# EAGLE design M8-Keypad-LCD (EAGLE 9.5.2)
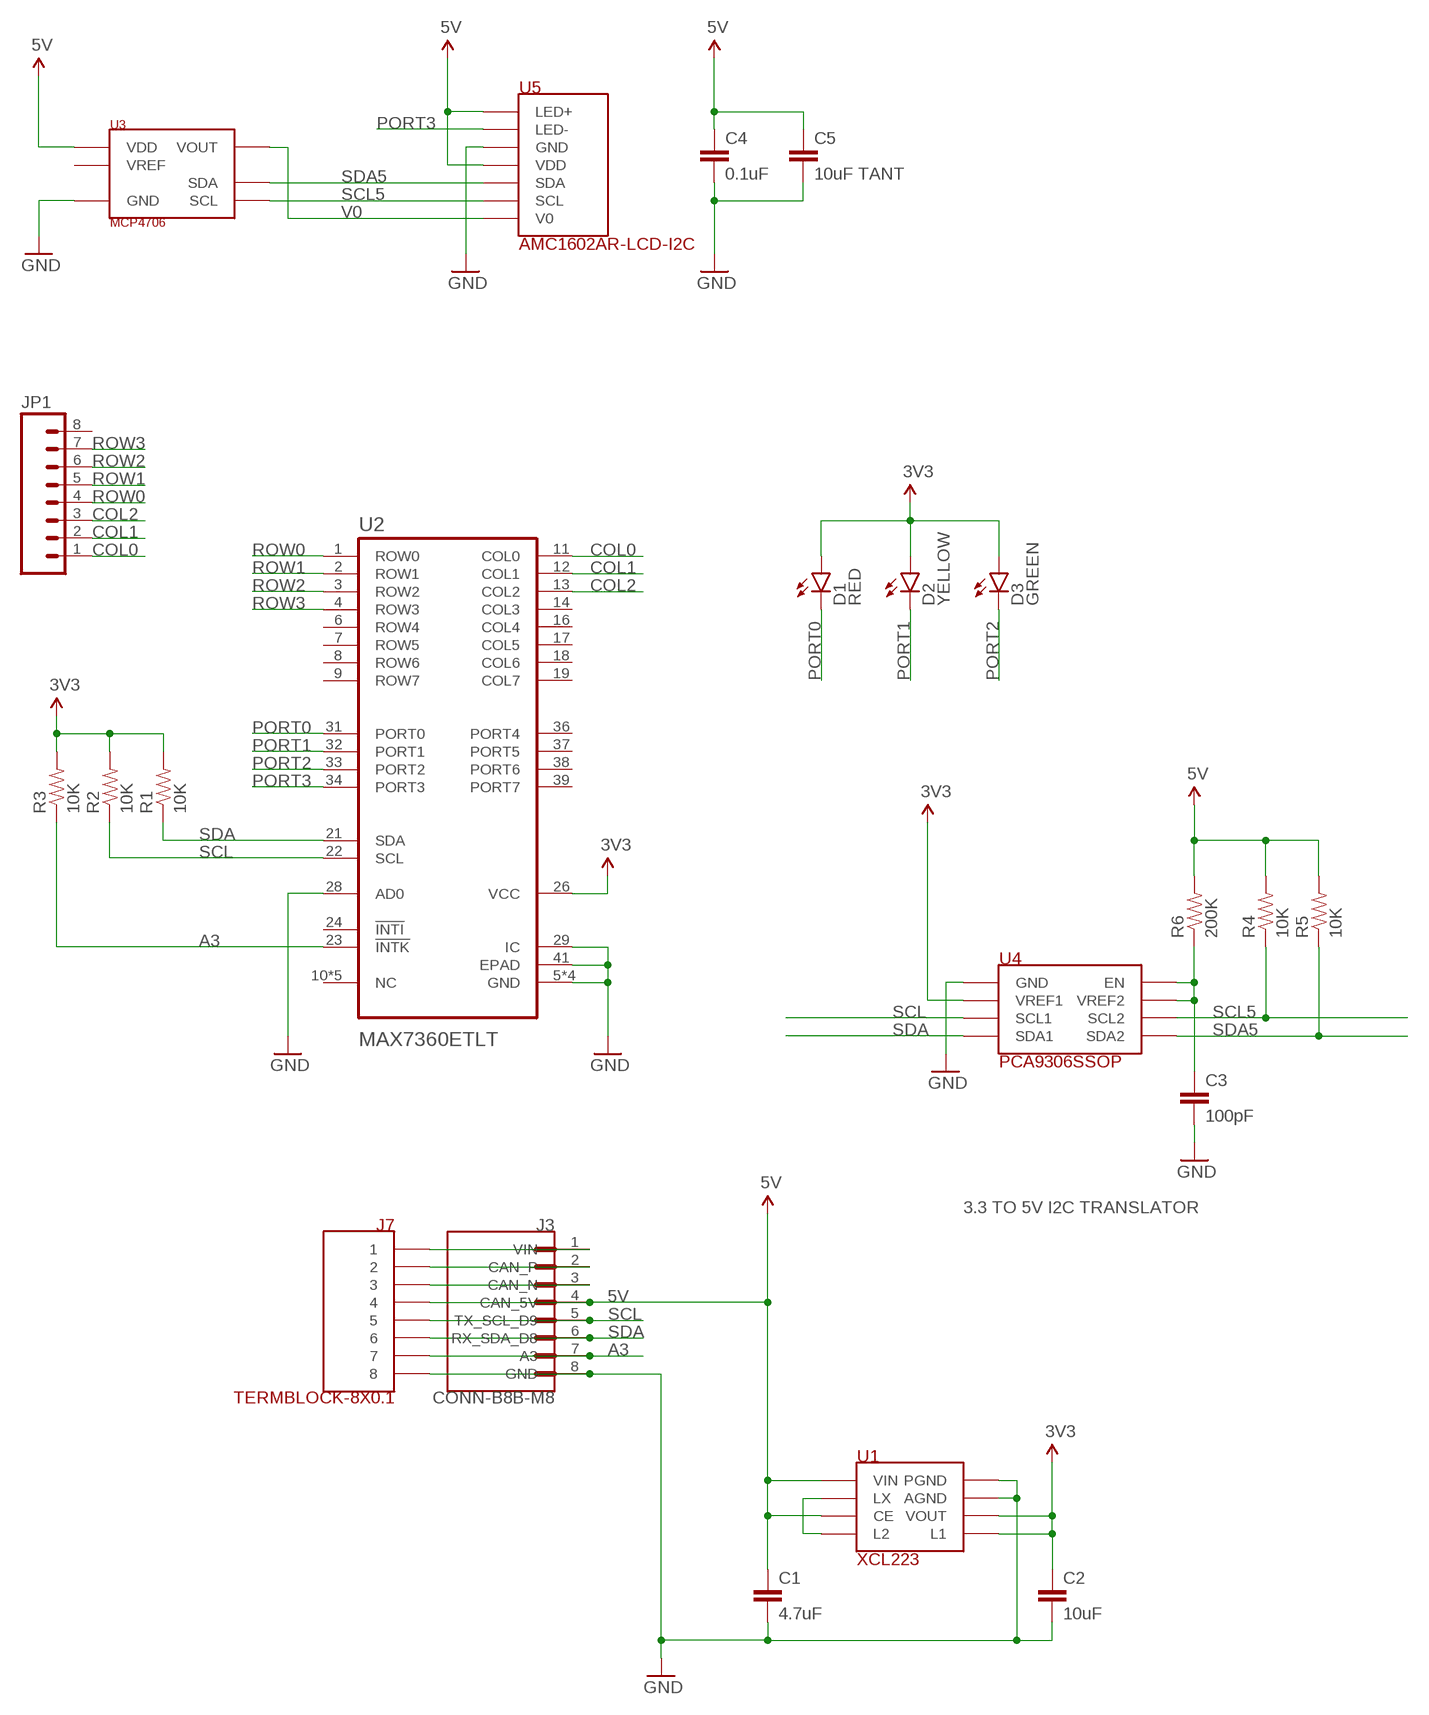
[diagram p0: schematic, sheet 1]

## Parts
C1  4.7uF  CAP-4.7UF-0603  [0603-CAP]
C2  10uF  CAP-10UF-0603  [0603-CAP]
C3  100pF  CAP-100PF-0603  [0603-CAP]
C4  0.1uF  CAP-0.1UF-0603  [0603-CAP]
C5  10uF TANT  CAP-10UF-1206-TANTALUM  [1206-KEMET]
D1  RED  LED-RED  [LED-0603]
D2  YELLOW  LED-YELLOW0603  [LED-0603]
D3  GREEN  LED-GREEN0603  [LED-0603]
J3  CONN-B8B-M8  [JST_B8B-PH-SM4-TB(LF)(SN)]
J7  TERMBLOCK-8X0.1  [TERMBLOCK-8X0.1]
JP1  M08SILK_FEMALE_PTH  [1X08]
R1  10K  RES-10K-06030603  [0603-RES]
R2  10K  RES-10K-06030603  [0603-RES]
R3  10K  RES-10K-06030603  [0603-RES]
R4  10K  RES-10K-06030603  [0603-RES]
R5  10K  RES-10K-06030603  [0603-RES]
R6  200K  RES-200K-0603  [0603-RES]
U1  XCL223  REG-XCL223  [REG-XCL223-LESS-CREAM]
U2  MAX7360ETLT  [QFN40P500X500X80-41N]
U3  MCP4706  MCP4706-DAC-I2C  [SOT-23-6-MICROCHIP]
U4  PCA9306SSOP  [8-SSOP-TI]
U5  AMC1602AR-LCD-I2C  [AMC1602AR]

## Nets
3V3: C2.1 D1.A D2.A D3.A R1.2 R2.2 R3.2 U1.3(VOUT) U1.7(L1) U2.26(VCC) U4.2(VREF1)
5V: C1.1 C4.1 C5.1 J3.4(CAN_5V) J7.P$4 R4.2 R5.2 R6.2 U1.4(CE) U1.6(VIN) U3.3(VDD) U5.1(LED+) U5.4(VDD)
A3: J3.7(A3) J7.P$7 R3.1 U2.23(!INTK)
CAN+: J3.2(CAN_P) J7.P$2
CAN-: J3.3(CAN_N) J7.P$3
COL0: JP1.1 U2.11(COL0)
COL1: JP1.2 U2.12(COL1)
COL2: JP1.3 U2.13(COL2)
GND: C1.2 C2.2 C3.2 C4.2 C5.2 J3.8(GND) J7.P$8 U1.1(PGND) U1.2(AGND) U2.5(GND) U2.15(GND) U2.25(GND) U2.28(AD0) U2.29(IC) U2.35(GND) U2.41(EPAD) U3.2(GND) U4.1(GND) U5.3(GND)
LX: U1.5(LX) U1.8(L2)
PORT0: D1.C U2.31(PORT0)
PORT1: D2.C U2.32(PORT1)
PORT2: D3.C U2.33(PORT2)
PORT3: U2.34(PORT3) U5.2(LED-)
ROW0: JP1.4 U2.1(ROW0)
ROW1: JP1.5 U2.2(ROW1)
ROW2: JP1.6 U2.3(ROW2)
ROW3: JP1.7 U2.4(ROW3)
SCL: J3.5(TX_SCL_D9) J7.P$5 R2.1 U2.22(SCL) U4.3(SCL1)
SCL5: R4.1 U3.5(SCL) U4.6(SCL2) U5.6(SCL)
SDA: J3.6(RX_SDA_D8) J7.P$6 R1.1 U2.21(SDA) U4.4(SDA1)
SDA5: R5.1 U3.4(SDA) U4.5(SDA2) U5.5(SDA)
V0: U3.1(VOUT) U5.7(V0)
VIN: J3.1(VIN) J7.P$1
VREF2_EN: C3.1 R6.1 U4.7(VREF2) U4.8(EN)
Unconnected: JP1.8 U2.6(ROW4) U2.7(ROW5) U2.8(ROW6) U2.9(ROW7) U2.10(NC) U2.14(COL3) U2.16(COL4) U2.17(COL5) U2.18(COL6) U2.19(COL7) U2.20(NC) U2.24(!INTI) U2.27(NC) U2.30(NC) U2.36(PORT4) U2.37(PORT5) U2.38(PORT6) U2.39(PORT7) U2.40(NC) U3.6(VREF)

## Notes on the sheet
- 3.3 TO 5V I2C TRANSLATOR

## Library data of the parts
C1 = rickk2:CAP-4.7UF-0603: Murata X5R series CAP CER 4.7UF 6.3V X5R 0603 $0.12 https://www.digikey.com/product-detail/en/murata-electronics-north-america/GRM188R60J475KE19J/490-6407-1-ND/3845604
C2 = rickk2:CAP-10UF-0603: CAP CER 10UF 16V X5R 0805 $ 0.21 https://www.digikey.com/product-detail/en/murata-electronics-north-america/GRM21BR61C106KE15L/490-3886-1-ND/965928
C3 = rickk2:CAP-100PF-0603: CAP 100PF 0603 https://www.digikey.com/product-detail/en/kemet/C0603C101J5GACTU/399-1061-1-ND/411336
C4 = rickk2:CAP-0.1UF-0603: CAP CER 0.1UF 16V X7R 0603 https://www.digikey.com/product-detail/en/murata-electronics-north-america/GRM188R71C104KA01D/490-1532-1-ND/587771
C5 = rickk2:CAP-10UF-1206-TANTALUM: CAP CER 10UF 16V X5R 0805 $ 0.21 https://www.digikey.com/product-detail/en/murata-electronics-north-america/GRM21BR61C106KE15L/490-3886-1-ND/965928
D1 = rickk2:LED-RED: LED RED CLEAR 0603 SMD $0.41 Red 631nm LED Indication - Discrete 2V 0603 (1608 Metric) 5mA@2V https://www.digikey.com/product-detail/en/lite-on-inc/LTST-C193KRKT-5A/160-1830-1-ND/2356251 Res = 270 ohm @ 3.3V Res = 680 ohm 1/8W @ 5V Res = 2.2K 1/8W @ 12V
D2 = rickk2:LED-YELLOW: Lite-On LTST-C193KSKT-5A LED YELLOW CLEAR 0603 SMD $ 0.41 Yellow 591nm LED Indication - Discrete 2V 0603 (1608 Metric) https://www.digikey.com/product-detail/en/lite-on-inc/LTST-C193KSKT-5A/160-1831-1-ND/2356253 R = 270 ohms @ 3.3V Stripe is on the anode (+) side on the bottom side!
D3 = rickk2:LED-GREEN: Lite-On LTST-C193KGKT-5A Green 572nm LED Indication - Discrete 2V 5 mA 0603 https://www.digikey.com/product-detail/en/lite-on-inc/LTST-C193KGKT-5A/160-1828-1-ND/2356247 Res = 270 ohm @ 3.3V, Res = 680 ohm 1/8W @ 5V
J3 = rickk2:CONN-B8B-M8: PH Series 2 mm Pitch 12 Position SMT Single Row Top Entry Shrouded Header
J7 = rickk2:TERMBLOCK-8X0.1: Term Block 8x0.1" 20-30AWG 6A 125V Max Side Entry On Shore Technology Inc. OSTVN08A150 TERM BLK 8P SIDE ENT 2.54MM PCB 8 Position Wire to Board Terminal Block Horizontal with Board 0.100" (2.54mm) Through Hole https://www.digikey.com/product-detail/en/on-shore-technology-inc/OSTVN08A150/ED10566-ND/1588868
JP1 = rickk2:M08: Header 8 Standard 8-pin 0.1" header. Use with straight break away headers (SKU : PRT-00116), right angle break away headers (PRT-00553), swiss pins (PRT-00743), machine pins (PRT-00117), and female headers (PRT-00115).; PROD_ID: CONN-08438
R1-R5 = rickk2:RES-10K-0603: RES SMD 10K OHM 5% 1/4W 0603 $ 0.10 https://www.digikey.com/product-detail/en/panasonic-electronic-components/ERJ-PA3J103V/P10KBZCT-ND/5036237
R6 = rickk2:RES-200K-0603: RES SMD 200K https://www.digikey.com/product-detail/en/panasonic-electronic-components/ERJ-3EKF2003V/P200KHCT-ND/198241
U1 = rickk2:REG-XCL223: Manufacturer: Torex Semiconductor Ltd Manufacturer Part Number: XCL223A333D2-G DC DC CONVERTER 3.3V Detailed Description: Non-Isolated PoL Modul $2.63 https://www.digikey.com/product-detail/en/torex-semiconductor-ltd/XCL223A333D2-G/893-1416-1-ND/8256118 CIN=4.7uF 10V CL = 10uF 10V VIN MAX=5.5V VOUT=3.3V
U2 = rickk2:MAX7360ETLT; DESCRIPTION: IC CTRLR KEY-SW I2C 40TQFN; DIGI-KEY_PART_NUMBER: MAX7360ETL+TCT-ND; MF: Maxim Integrated; MP: MAX7360ETL+T; PACKAGE: QFN-40 Maxim
U3 = rickk2:MCP4706-DAC-I2C: Microchip Technology MCP4706A0T-E/CH $ 0.71 8 Bit Digital to Analog Converter 1 SOT-23-6 https://www.digikey.com/product-detail/en/microchip-technology/MCP4706A0T-E-CH/MCP4706A0T-E-CHCT-ND/2684986
U4 = rickk2:PCA9306: IC TRNSLTR BIDIRECTIONAL SM8 PCA9306DCTR $0.67 https://www.digikey.com/product-detail/en/texas-instruments/PCA9306DCTR/296-18509-1-ND/809938 VREF1=3.3V VREF2=5V connect w/200K res and 100 pF cap to GND Use 8-SSOP version!
U5 = rickk2:AMC1602AR-LCD-I2C: Orient Display AMC1602AR-B-B6WTDW-I2C $7.49 COB CHAR 16X2 BLUE TRANSM I2C Character LCD Display Module Transmissive 5 x 8 Dots STN - Super-Twisted Nematic LED - White I²C 80.00mm x 36.00mm x 14.00mm https://www.digikey.com/product-detail/en/orient-display/AMC1602AR-B-B6WTDW-I2C/2544-AMC1602AR-B-B6WTDW-I2C-ND/12089223

## Board
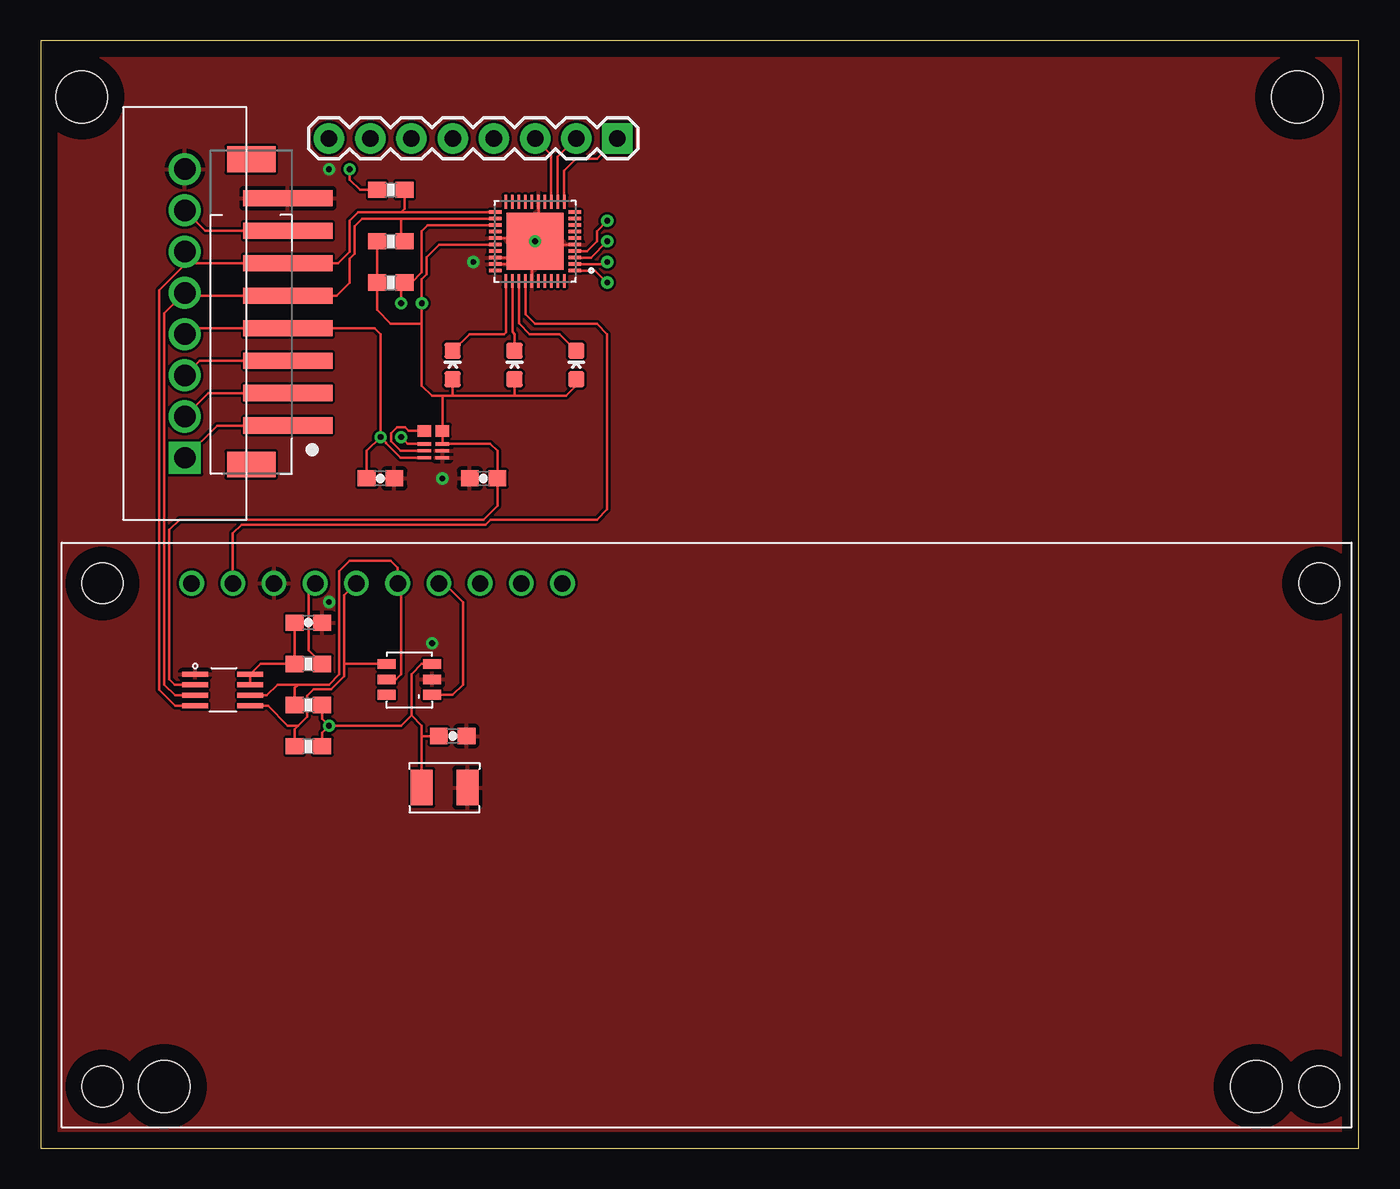
[diagram p1: board, top side]
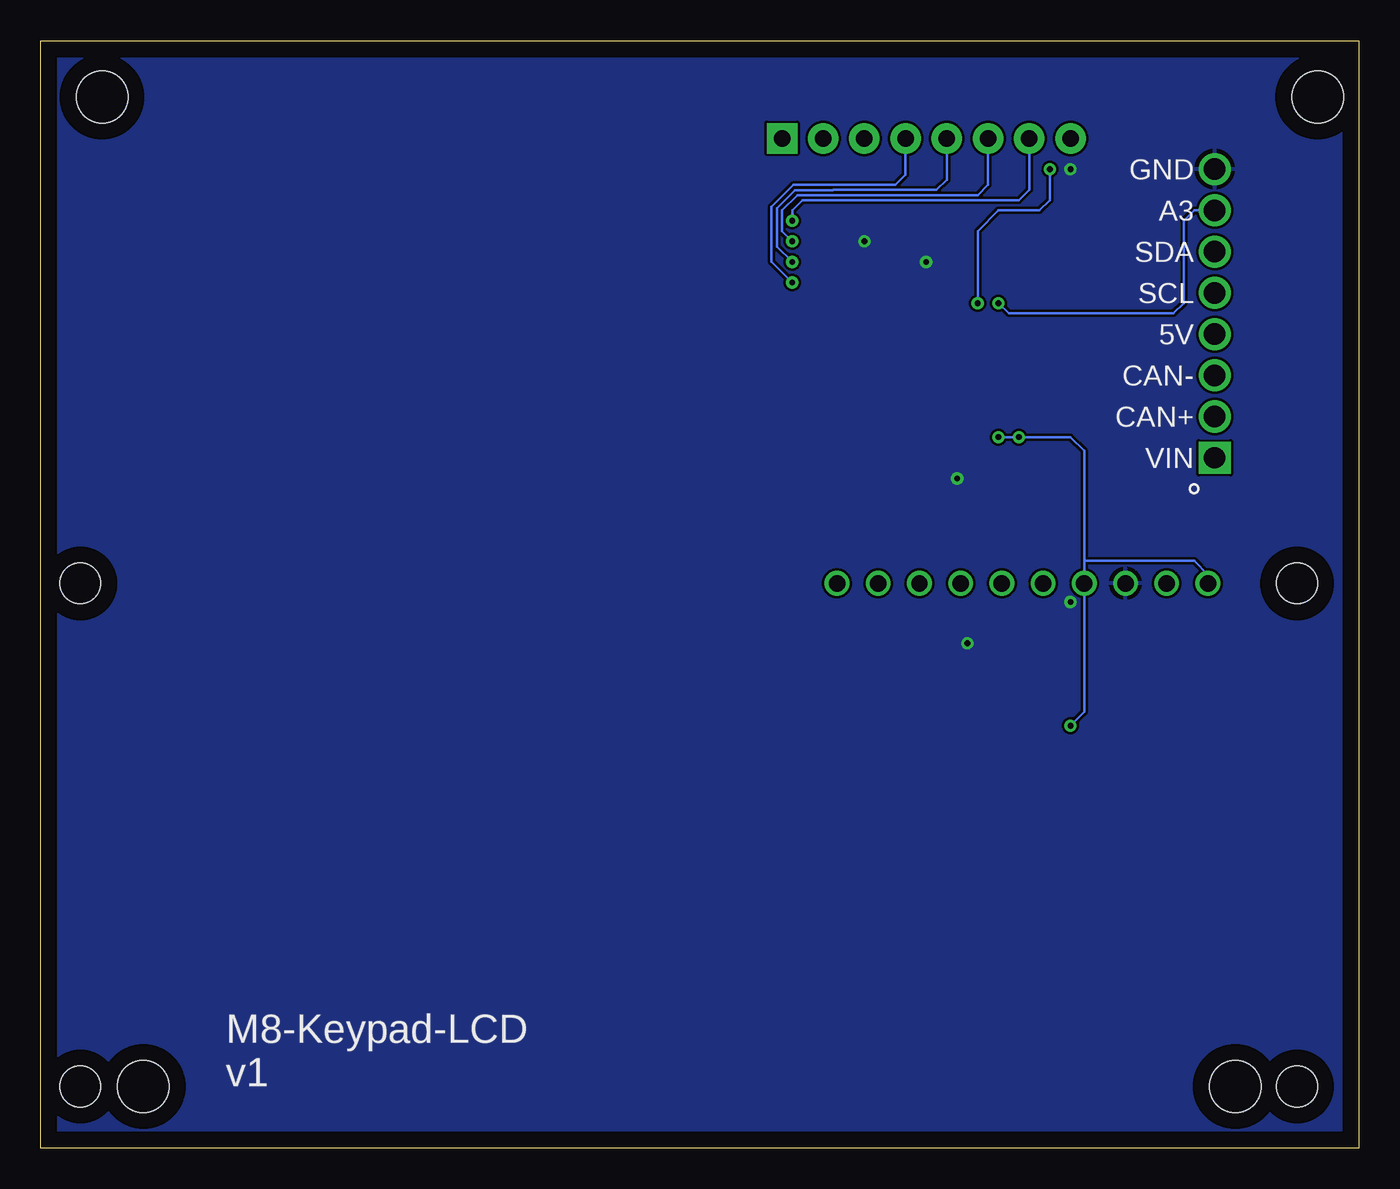
[diagram p2: board, bottom side, seen from below]

Size 81.26 x 68.25 mm. Coordinates in mm from the lower left corner, seen from the top.
Outline: 0,0 81.26,0 81.26,68.25 0,68.25 0,0
Copper layers (1*16): Top 0.035mm / dielectric 1.5mm / Bottom 0.035mm
Design rules "default": minimum track width 6mil, minimum drill 0.35mm, track to track 6mil, track to pad 6mil, pad to pad 6mil, via to via 6mil, smd to smd 6mil, copper to edge 40mil, drill to drill 6mil, minimum pad ring 10mil, minimum via ring 8mil, stop-mask expansion 4mil, vias tented up to drill 0mil, thermal gap 10mil
Holes 3.17 mm at 7.62,3.81 74.93,3.81 77.47,64.77 2.54,64.77

### Footprints (pad centres in the part's own frame; a part is rotated, then mirrored left to right if it is on the bottom)
0603-CAP = smd 1.1 x 1: 1 -0.85,0; 2 0.85,0
1206-KEMET = smd 1.35 x 2.2: 1 0,0; 2 2.82,0
LED-0603 = smd 1 x 1: A 0,-0.877; C 0,0.877
JST_B8B-PH-SM4-TB(LF)(SN) = smd 1 x 5.5: 1 -5,0; 2 -3,0; 3 -1,0; 4 1,0; 5 3,0; 6 5,0; 7 7,0; 8 9,0 | smd 1.6 x 3: P1 -7.4,2.25; P2 11.4,2.25
TERMBLOCK-8X0.1 = drill 1.321 square: P$1 -8.89,0 | drill 1.321: P$2 -6.35,0; P$3 -3.81,0; P$4 -1.27,0; P$5 1.27,0; P$6 3.81,0; P$7 6.35,0; P$8 8.89,0
1X08 = drill 1.016 pad 1.88 square: 1 0,0 | drill 1.016 pad 1.88: 2 2.54,0; 3 5.08,0; 4 7.62,0; 5 10.16,0; 6 12.7,0; 7 15.24,0; 8 17.78,0
0603-RES = smd 1.1 x 1: 1 -0.85,0; 2 0.85,0
REG-XCL223-LESS-CREAM = smd 0.85 x 0.21: 1 0,0; 2 0,0.43; 3 0,0.86; 4 -1.11,0.86; 5 -1.11,0.43; 6 -1.11,0 | smd 0.85 x 0.7: 7 0,1.655; 8 -1.11,1.655
QFN40P500X500X80-41N = smd 0.83 x 0.22: 1 -2.44,1.8; 2 -2.44,1.4; 3 -2.44,1; 4 -2.44,0.6; 5 -2.44,0.2; 6 -2.44,-0.2; 7 -2.44,-0.6; 8 -2.44,-1; 9 -2.44,-1.4; 10 -2.44,-1.8; 21 2.44,-1.8; 22 2.44,-1.4; 23 2.44,-1; 24 2.44,-0.6; 25 2.44,-0.2; 26 2.44,0.2; 27 2.44,0.6; 28 2.44,1; 29 2.44,1.4; 30 2.44,1.8 | smd 0.22 x 0.83: 11 -1.8,-2.44; 12 -1.4,-2.44; 13 -1,-2.44; 14 -0.6,-2.44; 15 -0.2,-2.44; 16 0.2,-2.44; 17 0.6,-2.44; 18 1,-2.44; 19 1.4,-2.44; 20 1.8,-2.44; 31 1.8,2.44; 32 1.4,2.44; 33 1,2.44; 34 0.6,2.44; 35 0.2,2.44; 36 -0.2,2.44; 37 -0.6,2.44; 38 -1,2.44; 39 -1.4,2.44; 40 -1.8,2.44 | smd 3.5 x 3.5: 41 0,0
SOT-23-6-MICROCHIP = smd 0.6 x 1.1: 1 0,0; 2 0.95,0; 3 1.9,0; 4 1.9,2.8; 5 0.95,2.8; 6 0,2.8
8-SSOP-TI = smd 0.3 x 1.6: 1 0,0; 2 0.65,0; 3 1.3,0; 4 1.95,0; 5 1.95,3.4; 6 1.3,3.4; 7 0.65,3.4; 8 0,3.4
AMC1602AR = drill 1.016: 1 5.5,31; 2 8.04,31; 3 10.58,31; 4 13.12,31; 5 15.66,31; 6 18.2,31; 7 20.74,31; 8 23.28,31; 9 25.82,31; 10 28.36,31 | hole 2.5: 0,31; 75,31; 75,0; 0,0

### Placement (x,y rotation side)
C1  20.95,41.27 0 top
C2  27.3,41.27 180 top
C3  16.51,32.38 0 top
C4  25.4,25.4 0 top
C5  23.5,22.23 0 top
D1  25.4,48.26 0 top
D2  29.21,48.26 0 top
D3  33.02,48.26 0 top
J3  15.24,49.53 90 top
J7  8.89,51.44 90 top
JP1  35.56,62.23 180 top
R1  21.59,59.05 180 top
R2  21.59,55.88 180 top
R3  21.59,53.34 180 top
R4  16.51,27.3 0 top
R5  16.51,24.77 0 top
R6  16.51,29.84 0 top
U1  24.77,42.55 0 top
U2  30.48,55.88 180 top
U3  24.13,27.94 90 top
U4  9.53,29.21 270 top
U5  3.81,3.81 0 top

### Tracks (layer width: path | path; a pad name or v marks a point on that pad's centre or on a via)
3V3  (via drill 0.35)
  Top 0.152: 23.5,50.8 v23.5,52.07 23.5,53.54 23.8,53.85 23.8,54.91 24.57,55.68 U2.26 | R1.2 19.68,59.05 19.05,59.69 v19.05,60.33 | 23.5,50.8 21.59,50.8 20.74,51.65 R3.2 R2.2 | 29.21,46.35 32.38,46.35 33.02,46.99 D3.A | 29.21,46.35 25.4,46.35 | 25.4,46.35 24.77,46.35 | 24.77,46.35 24.13,46.35 23.5,46.99 23.5,50.8 | 24.77,46.35 U1.7 U1.3 27.71,43.41 28.16,42.97 C2.1 28.16,39.59 27.3,38.73 8.56,38.73 7.92,38.1 7.92,28.91 8.26,28.57 9.51,28.57 U4.2 | D2.A 29.21,46.35 | D1.A 25.4,46.35
  Bottom 0.152: v19.05,60.33 19.05,58.42 19.68,57.78 22.23,57.78 23.5,56.52 v23.5,52.07
5V  (via drill 0.35)
  Top 0.152: J7.P$4 9.26,50.53 J3.4 20.59,50.53 20.95,50.16 v20.95,43.81 | U1.4 22.64,43.41 v22.23,43.81 | C1.1 20.11,42.97 v20.95,43.81 | v20.95,43.81 21.31,43.46 21.31,43.44 22.21,42.55 U1.6 | R6.2 16.51,30.7 16.51,34.39 U5.4 | R5.2 17.36,25.61 v17.78,26.04 | R4.2 17.36,26.45 v17.78,26.04 | U3.3 23.49,29.84 22.86,29.21 22.86,26.67 | 22.86,26.67 22.23,26.04 v17.78,26.04 | C5.1 23.5,25.4 | 23.5,25.4 23.5,26.04 22.86,26.67 | C4.1 23.5,25.4
  Bottom 0.152: v22.23,43.81 v20.95,43.81 17.78,43.81 16.93,42.97 16.93,36.2 | 16.93,36.2 U5.4 16.93,26.89 v17.78,26.04 | U5.1 9.31,35.34 10.16,36.2 16.93,36.2
A3  (via drill 0.35)
  Top 0.152: J3.7 10.14,56.53 J7.P$7 | U2.23 23.86,56.88 23.5,56.52 23.5,53.98 22.86,53.34 R3.1 22.23,53.12 v22.23,52.07
  Bottom 0.152: v22.23,52.07 21.59,51.44 11.43,51.44 10.79,52.07 10.79,57.15 10.16,57.78 J7.P$7
CAN+
  Top 0.152: J3.2 10.34,46.53 J7.P$2
CAN-
  Top 0.152: J3.3 9.79,48.53 J7.P$3
COL0
  Top 0.152: U2.11 32.28,60.22 33.02,60.96 34.29,60.96 JP1.1
COL1
  Top 0.152: U2.12 31.88,61.09 JP1.2
COL2
  Top 0.152: U2.13 31.48,61.23 JP1.3
GND  (via drill 0.35)
  Top 0.152: U2.25 30.28,56.08 U2.41 | U2.5 30.68,55.68 U2.41 | U2.15 30.68,56.08 U2.41 | U2.35 30.28,54.61 | 30.28,54.61 30.28,55.68 U2.41 | U2.28 29.48,54.88 U2.41 | U2.29 30.15,54.48 30.28,54.61
  other vias: 24.77,41.27 30.48,55.88 17.78,60.33 26.67,54.61 17.78,33.66 24.13,31.11
  pour Top: 0,0 0,71.12 93.98,71.12 93.98,0
  pour Bottom: 0,0 0,72.39 91.44,72.39 91.44,0
LX
  Top 0.152: U1.8 22.7,44.2 22.48,44.42 21.97,44.42 21.62,44.07 21.62,43.56 22.21,42.98 U1.5
PORT0
  Top 0.152: U2.31 28.68,50.27 28.57,50.16 26.43,50.16 D1.C
PORT1
  Top 0.152: U2.32 29.08,50.3 29.21,50.16 D2.C
PORT2
  Top 0.152: U2.33 29.48,50.84 30.15,50.16 31.99,50.16 D3.C
PORT3
  Top 0.152: U2.34 29.88,51.4 30.48,50.8 34.29,50.8 34.92,50.16 34.92,39.37 34.29,38.73 27.74,38.73 27.43,38.43 12.39,38.43 11.85,37.88 U5.2
ROW0  (via drill 0.35)
  Top 0.152: U2.1 34.19,54.08 v34.92,53.34
  Bottom 0.152: JP1.4 27.94,59.99 28.57,59.36 34.85,59.36 36.2,58.01 36.2,54.61 v34.92,53.34
ROW1  (via drill 0.35)
  Top 0.152: U2.2 34.8,54.48 v34.92,54.61
  Bottom 0.152: JP1.5 25.4,59.69 26.04,59.05 32.38,59.05 32.41,59.03 34.75,59.03 35.87,57.91 35.87,55.55 v34.92,54.61
ROW2  (via drill 0.35)
  Top 0.152: U2.3 33.92,54.88 v34.92,55.88
  Bottom 0.152: JP1.6 22.86,59.36 23.5,58.73 34.62,58.73 35.56,57.78 35.56,56.52 v34.92,55.88
ROW3  (via drill 0.35)
  Top 0.152: U2.4 33.69,55.28 34.29,55.88 34.29,56.52 v34.92,57.15
  Bottom 0.152: JP1.7 20.32,59.05 20.95,58.42 34.29,58.42 34.92,57.78 v34.92,57.15
SCL
  Top 0.152: U2.22 22.23,57.28 | 22.23,57.28 19.82,57.28 19.36,56.82 19.36,55.12 19.05,54.81 19.05,53.34 18.24,52.53 J3.5 9.06,52.53 J7.P$5 7.62,51.44 7.62,28.57 8.29,27.91 U4.3 | R2.1 22.23,56.09 22.23,57.28
SCL5
  Top 0.152: U4.6 13.94,27.91 14.61,28.57 15.88,28.57 | 15.88,28.57 17.78,28.57 18.41,29.21 18.41,35.56 19.05,36.2 21.59,36.2 22.01,35.77 22.01,34.92 | 22.01,34.92 U5.6 | R4.1 15.66,28.36 15.88,28.57 | U3.5 21.91,28.89 22.23,29.21 22.23,34.71 22.01,34.92
SDA
  Top 0.152: U2.21 22.23,57.68 | 22.23,57.68 19.58,57.68 19.05,57.15 19.05,55.24 18.34,54.53 J3.6 9.61,54.53 J7.P$6 8.89,54.43 7.32,52.85 7.32,28.25 8.3,27.26 U4.4 | R1.1 22.44,57.9 22.23,57.68
SDA5
  Top 0.152: U4.5 14.02,27.26 15.24,26.04 15.88,26.04 | U5.5 18.72,34.06 18.72,29.84 | 18.72,29.84 18.72,29.08 17.91,28.27 16.84,28.27 16.44,27.87 16.44,26.6 15.88,26.04 | R5.1 15.66,25.82 15.88,26.04 | U3.4 18.73,29.84 18.72,29.84
V0
  Top 0.152: U3.1 25.4,27.94 26.04,28.57 26.04,33.66 24.88,34.81 U5.7
VIN
  Top 0.152: J7.P$1 10.88,44.53 J3.1
VREF2_EN
  Top 0.152: U4.7 U4.8 13.56,29.84 R6.1 C3.1

### Text on the board
bPlace: GND | A3 | SDA | SCL | 5V | CAN- | CAN+ | VIN | M8-Keypad-LCD / v1